# EAGLE design ICS40300-preamp-surfacemount_Rev-E (EAGLE 8.2.1)
COMPANY: ADAFRUIT INDUSTRIES; DRAWN: KTOWN; REV: A
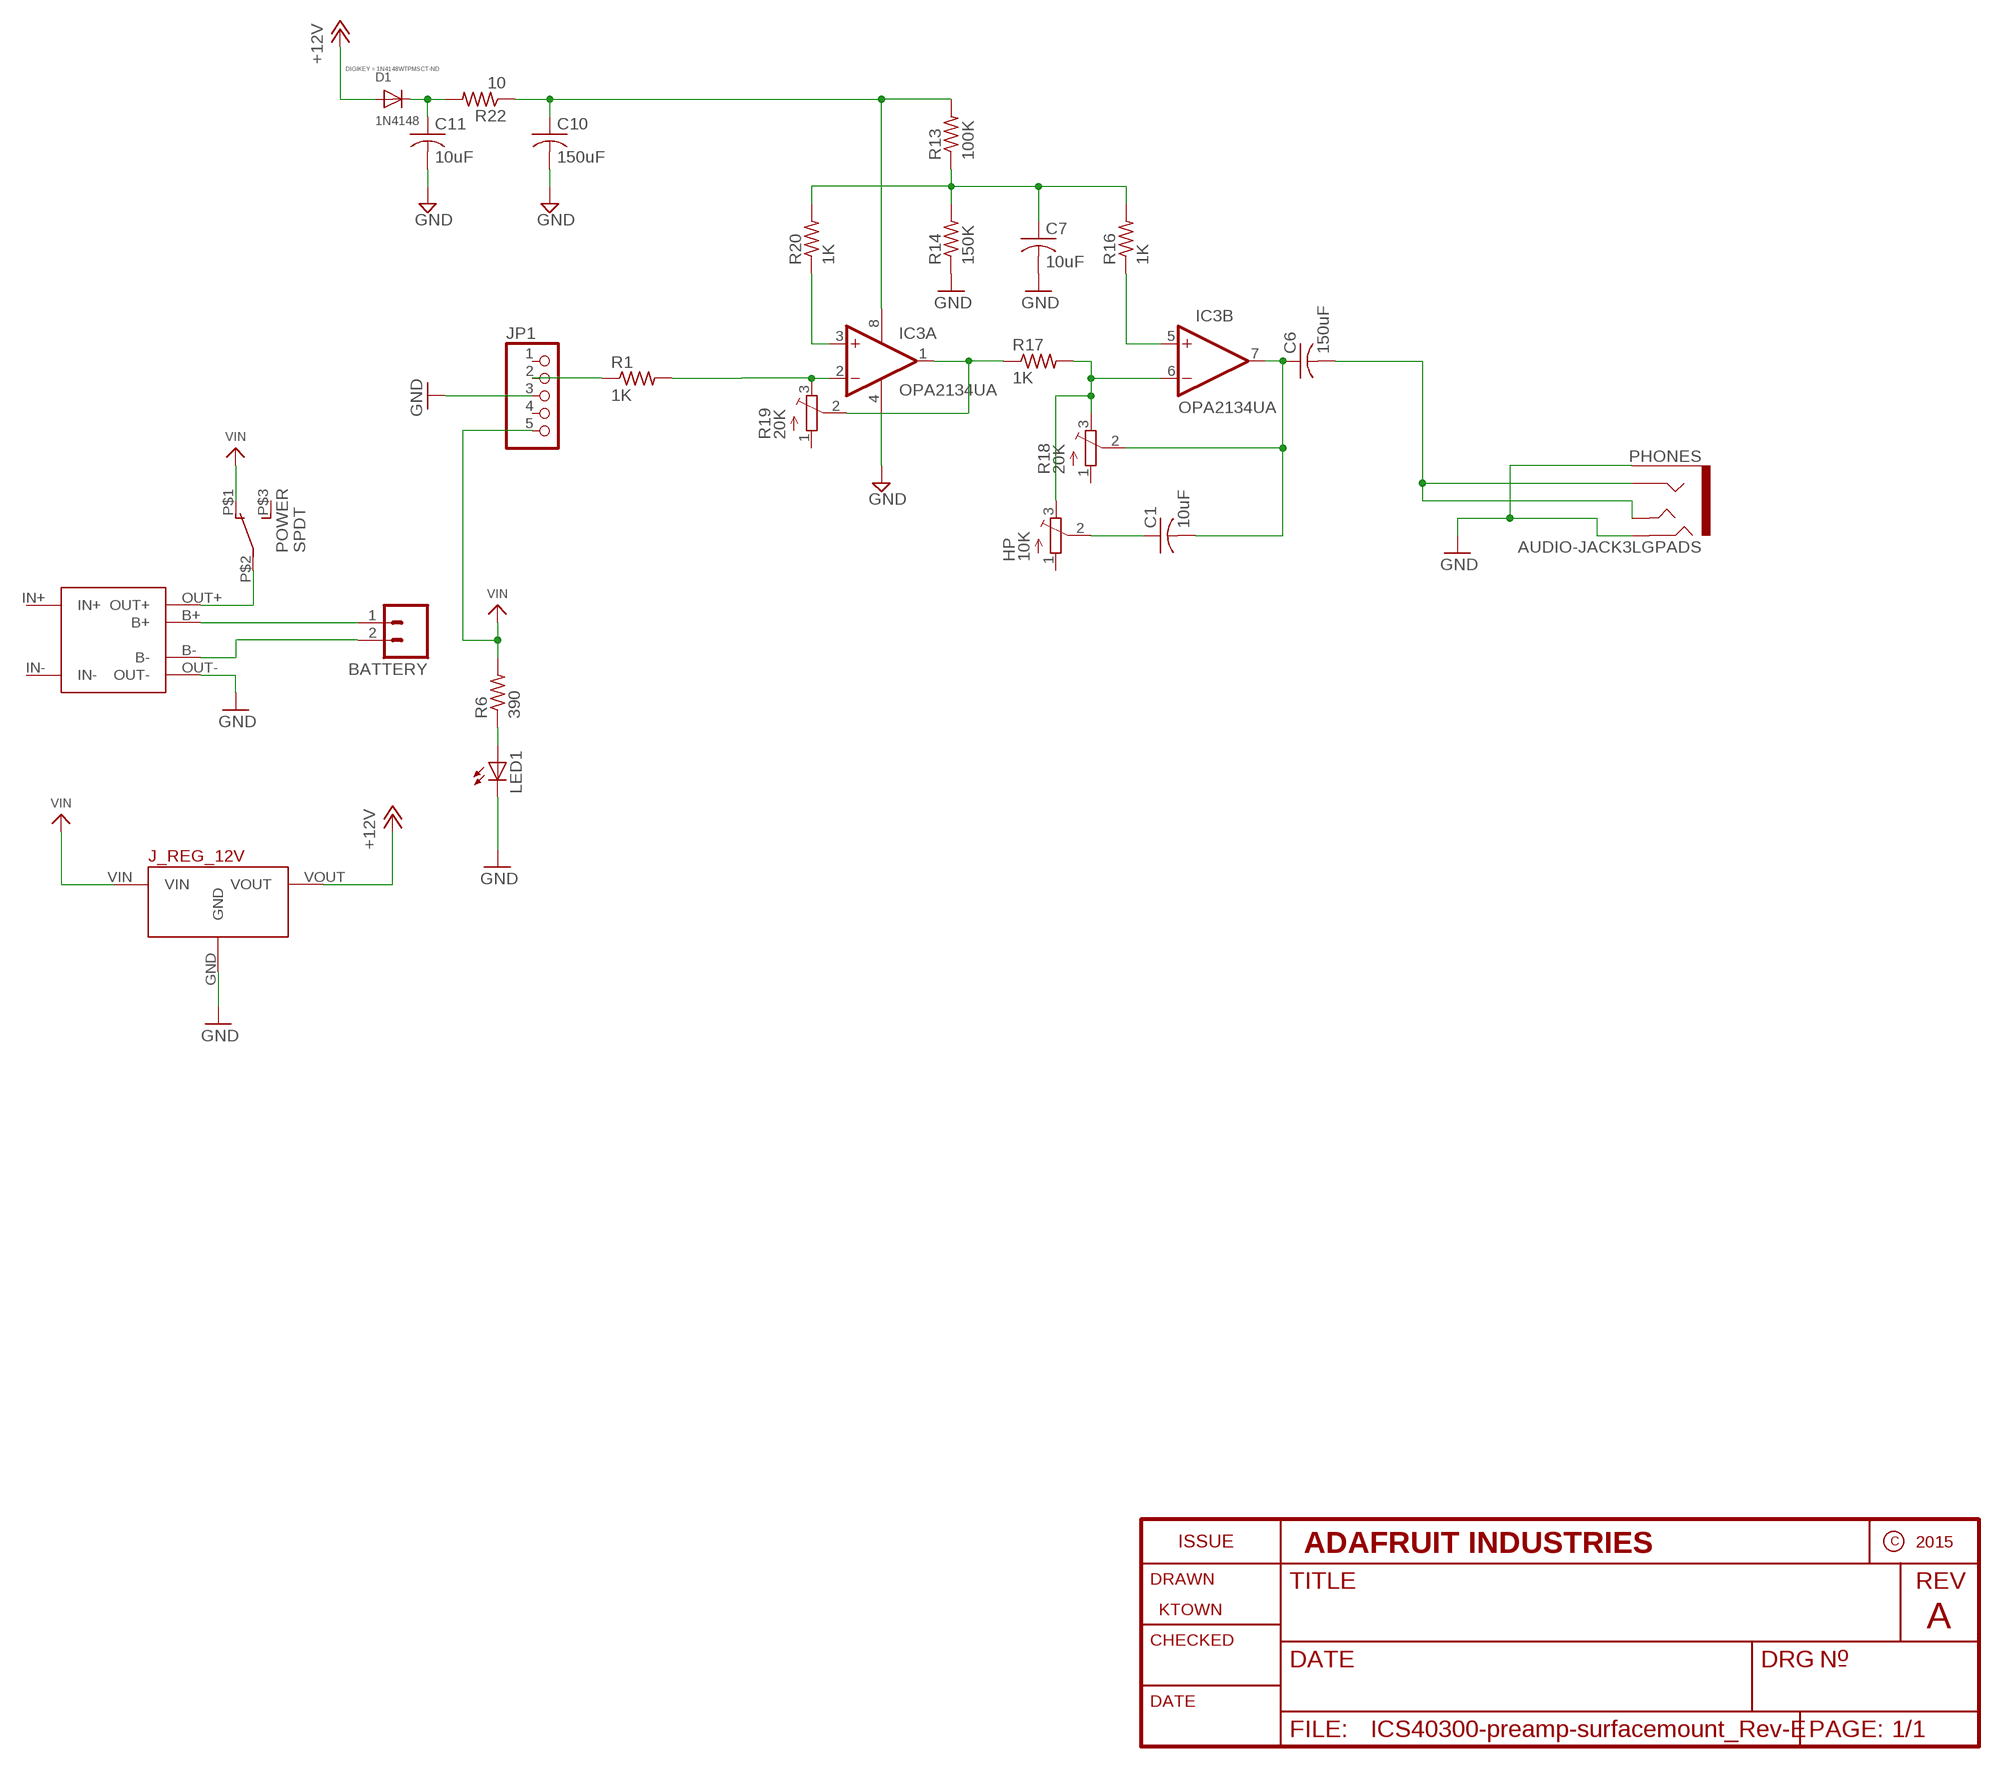
[diagram p0: schematic, sheet 1]

## Parts
BATTERY  M02LOCK  [1X02_LOCK]
C1  10uF  C-USC0805K  [C0805K]
C6  150uF  C-US6032  [CT6032]
C7  10uF  C-USC0805K  [C0805K]
C10  150uF  C-US6032  [CT6032]
C11  10uF  C-USC0805K  [C0805K]
D1  1N4148  DIODESOD-123  [SOD-123]
HP  10K  TRIMPOTTC33X  [TC33X]
IC3  OPA2134UA  [SO08]
J_REG_12V  POLOLU_VOLTAGE_REGULATORS_3PIN  [POLOLU_5V-12V_STEPUP_U3V12F5-U3V12F12]
JP1  HEADER-1X576MIL  [1X05_ROUND_76]
LED1  LED3MM  [LED3MM]
PHONES  AUDIO-JACK3LGPADS  [AUDIO-JACK-TRRS-SMD]
POWER  SPDT  SWITCH_SPDTCL-SB-12B  [SWITCH_SPDT_CL-SB-12B]
R1  1K  R-US_R0805  [R0805]
R6  390  R-US_R0805  [R0805]
R13  100K  R-US_R0603  [R0603]
R14  150K  R-US_R0603  [R0603]
R16  1K  R-US_R0603  [R0603]
R17  1K  R-US_R0603  [R0603]
R18  20K  TRIMPOTTC33X  [TC33X]
R19  20K  TRIMPOTTC33X  [TC33X]
R20  1K  R-US_R0603  [R0603]
R22  10  R-US_R0603  [R0603]
U$1  TP4056-MODULETP4056  [TP4056-LITHIUM-PROTECTED-MODULE-MOVED-PAD]

## Nets
+12V: D1.A J_REG_12V.VOUT
GND: C7.2 C10.- C11.2 IC3.4(A:V-) J_REG_12V.GND JP1.3 LED1.K(C) PHONES.EARTH PHONES.RING2 R14.1 U$1.OUT-
N$1: JP1.2 R1.1
N$3: POWER.P$2 U$1.OUT+
N$4: C1.1 HP.2(S)
N$5: BATTERY.1 U$1.B+
N$6: BATTERY.2 U$1.B-
N$13: IC3.5(B:+IN) R16.1
N$14: C1.2 C6.+ IC3.7(B:OUT) R18.2(S)
N$15: HP.3(E) IC3.6(B:-IN) R17.2 R18.3(E)
N$16: LED1.A R6.1
N$17: C7.1 R13.1 R14.2 R16.2 R20.2
N$18: IC3.3(A:+IN) R20.1
N$19: IC3.1(A:OUT) R17.1 R19.2(S)
N$21: IC3.2(A:-IN) R1.2 R19.3(E)
N$25: C6.- PHONES.RING1 PHONES.TIP
N$28: C11.1 D1.C R22.2
N$32: C10.+ IC3.8(A:V+) R13.2 R22.1
VIN: J_REG_12V.VIN JP1.5 POWER.P$1 R6.2
Unconnected: HP.1(A) JP1.1 JP1.4 POWER.P$3 R18.1(A) R19.1(A)

## Power pins joined to a net without a drawn wire
IN+: U$1.IN+
IN-: U$1.IN-

## Library data of the parts
BATTERY = CMU-ArtFab:M02: Header 2 Standard 2-pin 0.1" header. Use with straight break away headers (SKU : PRT-00116), right angle break away headers (PRT-00553), swiss pins (PRT-00743), machine pins (PRT-00117), and female headers (PRT-00115). Molex polarized connector foot print use with SKU : PRT-08233 with associated crimp pins and housings.
C1 C6 C7 C10 C11 = adafruit:C-US: CAPACITOR, American symbol
D1 = adafruit:DIODE: Diode SMADIODE - SMA Surface Mount Package 20V 1A Schottky Diode Digikey: 641-1014-6-ND DO-1N4148 - Through Hole Small Current Diode SOD-123 20V 1 A (.5mV Vf) Schottky Diode - Digikey: MBRX120TPMSCT-ND SOD-323 10V 570mA (.38mV Vf, 3ns) Schottky Diode - Digikey: ZLLS410CT-ND SOD-523 30V 30mA Schottky Diode (RB751S-40TE61) - Digikey: RB751S-40TE61CT-ND SOT23-R/W - SOT23 Package (R = Solder Paste/Reflow Ovens, W = Hand-Soldering) BAT54Film 40V 300mA - Digikey: 497-7162-1-ND; DIGIKEY: 1N4148WTPMSCT-ND
HP R18 R19 = adafruit:TRIMPOT: SMT trimmer potentiometer part number TC33X http://www.ladyada.net/library/eagle
IC3 = linear:OPA2*: Dual Operational Amplifier Low Power, Single-Supply, Rail-To-Rail Operational Amplifier Source: http://focus.ti.com/lit/ds/symlink/opa2345.pdf http://focus.ti.com .. opa241.pdf http://focus.ti.com/lit/ds/symlink/opa2134.pdf
J_REG_12V = CMU-ArtFab:POLOLU_VOLTAGE_REGULATORS_3PIN: Polulu 5V Step-Up/Step-Down Voltage REgulator S7V7F5
JP1 = microbuilder:HEADER-1X5: PIN HEADER
LED1 = led:LED: LED OSRAM: - CHIPLED LG R971, LG N971, LY N971, LG Q971, LY Q971, LO R971, LY R971 LH N974, LH R974 LS Q976, LO Q976, LY Q976 LO Q996 - Hyper CHIPLED LW Q18S LB Q993, LB Q99A, LB R99A - SideLED LS A670, LO A670, LY A670, LG A670, LP A670 LB A673, LV A673, LT A673, LW A673 LH A674 LY A675 LS A676, LA A676, LO A676, LY A676, LW A676 LS A679, LY A679, LG A679 - Hyper Micro SIDELED® LS Y876, LA Y876, LO Y876, LY Y876 LT Y87S - SmartLED LW L88C, LW L88S LB L89C, LB L89S, LG L890 LS L89K, LO L89K, LY L89K LS L896, LA L896, LO L896, LY L896 - TOPLED LS T670, LO T670, LY T670, LG T670, LP T670 LSG T670, LSP T670, LSY T670, LOP T670, LYG T670 LG T671, LOG T671, LSG T671 LB T673, LV T673, LT T673, LW T673 LH T674 LS T676, LA T676, LO T676, LY T676, LB T676, LH T676, LSB T676, LW T676 LB T67C, LV T67C, LT T67C, LS T67K, LO T67K, LY T67K, LW E67C LS E67B, LA E67B, LO E67B, LY E67B, LB E67C, LV E67C, LT E67C LW T67C LS T679, LY T679, LG T679 LS T770, LO T770, LY T770, LG T770, LP T770 LB T773, LV T773, LT T773, LW T773 LH T774 LS E675, LA E675, LY E675, LS T675 LS T776, LA T776, LO T776, LY T776, LB T776 LHGB T686 LT T68C, LB T68C - Hyper Mini TOPLED® LB M676 - Mini TOPLED Santana® LG M470 LS M47K, LO M47K, LY M47K Source: http://www.osram.convergy.de LUXEON: - LUMILED® LXK2-PW12-R00, LXK2-PW12-S00, LXK2-PW14-U00, LXK2-PW14-V00 LXK2-PM12-R00, LXK2-PM12-S00, LXK2-PM14-U00 LXK2-PE12-Q00, LXK2-PE12-R00, LXK2-PE12-S00, LXK2-PE14-T00, LXK2-PE14-U00 LXK2-PB12-K00, LXK2-PB12-L00, LXK2-PB12-M00, LXK2-PB14-N00, LXK2-PB14-P00, LXK2-PB14-Q00 LXK2-PR12-L00, LXK2-PR12-M00, LXK2-PR14-Q00, LXK2-PR14-R00 LXK2-PD12-Q00, LXK2-PD12-R00, LXK2-PD12-S00 LXK2-PH12-R00, LXK2-PH12-S00 LXK2-PL12-P00, LXK2-PL12-Q00, LXK2-PL12-R00 Source: www.luxeon.com KINGBRIGHT: KA-3528ASYC Source: www.kingbright.com
PHONES = Daniel:AUDIO-JACK3: Audio jack - 3.5mm TRRS variety - two rings.
POWER = CMU-ArtFab:SWITCH_SPDT
R1 R6 R13 R14 R16 R17 R20 R22 = CMU-ArtFab:R-US_: RESISTOR, American symbol
U$1 = CMU-ArtFab:TP4056-MODULE

## Board
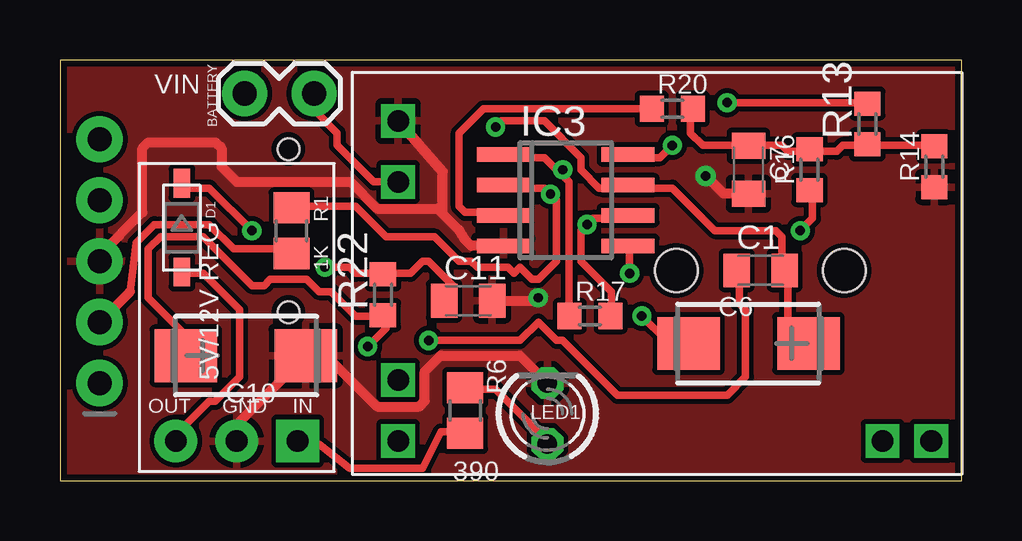
[diagram p1: board, top side]
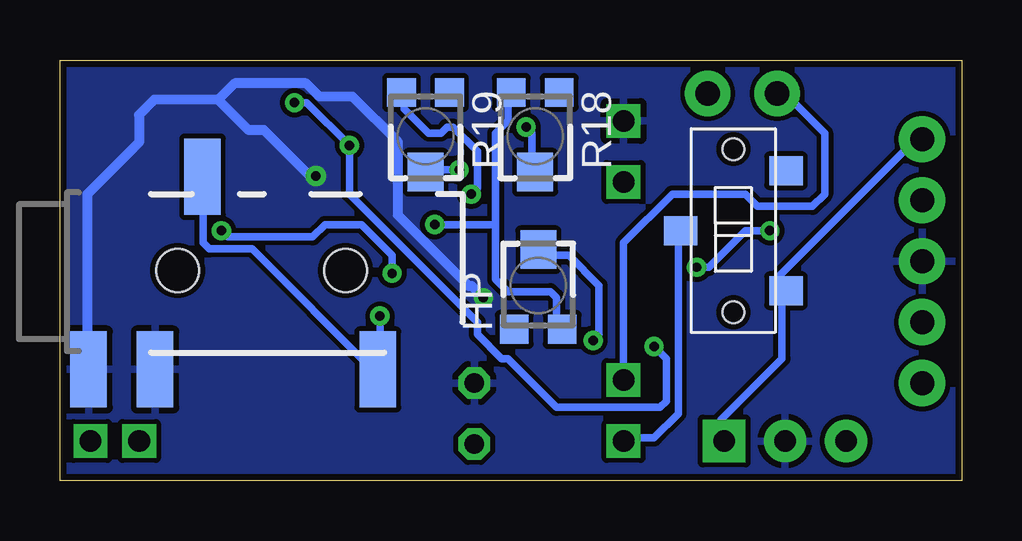
[diagram p2: board, bottom side, seen from below]

Size 37.59 x 17.53 mm. Coordinates in mm from the lower left corner, seen from the top.
Outline: 0,0 37.59,0 37.59,17.53 0,17.53 0,0
Copper layers (1*16): Top 0.035mm / dielectric 1.5mm / Bottom 0.035mm
Design rules "adafruit *": minimum track width 12mil, minimum drill 15.5mil, track to track 8mil, track to pad 8mil, pad to pad 8mil, via to via 8mil, smd to smd 8mil, copper to edge 10mil, drill to drill 8mil, minimum pad ring 10mil, minimum via ring 8mil, stop-mask expansion 2mil, vias tented up to drill 20mil, thermal gap 10mil

### Footprints (pad centres in the part's own frame; a part is rotated, then mirrored left to right if it is on the bottom)
1X02_LOCK = drill 1.016 pad 1.88: 1 -0.178,0; 2 2.718,0
C0805K = smd 1.1 x 1.4: 1 -1,0; 2 1,0
CT6032 = smd 2.6 x 2.2: + 2.5,0; - -2.5,0
SOD-123 = smd 1.2 x 0.7: A 1.85,0; C -1.85,0
TC33X = smd 1.2 x 1.2: 1 -1,-1.825; 3 1,-1.825 | smd 1.5 x 1.6: 2 0,1.5
SO08 = smd 0.6 x 2.2: 1 -1.905,-2.6; 2 -0.635,-2.6; 3 0.635,-2.6; 4 1.905,-2.6; 5 1.905,2.6; 6 0.635,2.6; 7 -0.635,2.6; 8 -1.905,2.6
POLOLU_5V-12V_STEPUP_U3V12F5-U3V12F12 = drill 0.9 pad 1.778: GND 0,-6.35; VOUT -2.54,-6.35 | drill 0.9 pad 1.778 square: VIN 2.54,-6.35
1X05_ROUND_76 = drill 1 pad 1.93: 1 -5.08,0; 2 -2.54,0; 3 0,0; 4 2.54,0; 5 5.08,0
LED3MM = drill 0.813 octagon: A -1.27,0; K 1.27,0
AUDIO-JACK-TRRS-SMD = smd 1.524 x 3.175: EARTH -2.114,-5.271; RING1 2.644,2.759; RING2 0.66,-5.271; TIP 9.948,-5.271 | hole 1.778: 1.6,-1.15; 8.6,-1.15
SWITCH_SPDT_CL-SB-12B = smd 1.2 x 1.4: P$1 -2.5,-2.2; P$2 0,2.2; P$3 2.5,-2.2 | hole 0.9: -3.4,0; 3.4,0
R0805 = smd 1.3 x 1.5: 1 -0.95,0; 2 0.95,0
R0603 = smd 1 x 1.1: 1 -0.85,0; 2 0.85,0
TP4056-LITHIUM-PROTECTED-MODULE-MOVED-PAD = drill 0.9 square: B+ 10.795,4.445; B- 10.795,-3.81; IN+ -11.43,6.985; IN- -9.398,6.985; OUT+ 10.795,6.985; OUT- 10.795,-6.35

### Placement (x,y rotation side)
BATTERY  7.87,16.13 0 top
C1  29.21,8.76 0 top
C6  28.7,5.71 0 top
C7  28.7,12.95 270 top
C10  7.75,5.21 180 top
C11  17.02,7.49 0 top
D1  5.08,10.54 270 top
HP  17.65,8.13 0 bottom
IC3  21.08,11.68 270 top
J_REG_12V  7.37,8 0 top
JP1  1.65,9.14 90 top
LED1  20.32,2.79 90 top
PHONES  34.29,9.91 0 bottom
POWER  9.52,10.41 90 bottom
R1  9.65,10.41 90 top
R6  16.89,2.92 270 top
R13  33.66,14.86 90 top
R14  36.45,13.08 90 top
R16  31.24,12.95 90 top
R17  22.1,6.86 0 top
R18  17.78,14.35 180 bottom
R19  22.35,14.35 180 bottom
R20  25.53,15.49 0 top
R22  13.46,7.75 90 top
U$1  24.89,8.64 180 top

### Tracks (layer width: path | path; a pad name or v marks a point on that pad's centre or on a via)
+12V
  Top 0.305: D1.A 5.21,8.64 5.97,8.64 7.49,7.11 7.49,4.32 6.48,3.3 6.22,3.3 4.7,1.78 J_REG_12V.VOUT
GND  (via drill 0.39 pad 0.8, 0.4 pad 0.85)
  Top 0.406: IC3.4 17.14,9.78 16.89,10.03 16.64,10.44 15.95,11.12 | U$1.OUT- 15.95,12.88 15.95,11.12 | JP1.3 1.65,9.4 3.43,11.18 3.43,13.84 3.68,14.1 6.48,14.1 6.73,13.84 6.73,13.08 7.37,12.45 12.11,12.45 13.23,11.34 15.74,11.34 15.95,11.12 | J_REG_12V.GND 7.37,2.33 C10.- 11.1,5.21 13.23,3.08 14.97,3.08 15.21,3.32 15.21,4.54 15.87,5.21 19.18,5.21 LED1.K | C11.2 19.81,7.49 v19.94,7.62 | C7.2 27.67,11.95 v26.92,12.7
  Bottom 0.406: v26.92,12.7 27.18,12.7 29.08,14.61 29.72,14.61 30.99,15.88 | 30.99,15.88 33.66,15.88 34.29,15.24 34.29,14.1 36.45,11.94 36.45,4.68 PHONES.EARTH | v19.94,7.62 20.42,8.1 20.54,8.1 23.51,11.06 23.51,14.11 25.4,16 26.77,16 27.32,16.55 30.31,16.55 30.99,15.88
  pour Top: 37.97,-0.76 37.97,19.05 -0.25,19.05 -0.25,-0.76
  pour Bottom: -0.25,-0.76 37.97,-0.76 37.97,19.81 -0.25,19.81
N$1
  Top 0.305: 2.92,7.87 3.17,9.91 3.94,10.67 6.22,10.67 7.24,9.65 9.52,9.65 R1.1
  Top 0.406: JP1.2 2.92,7.87
N$3
  Bottom 0.305: POWER.P$2 11.81,10.41 11.81,2.79 12.83,1.78 14.1,1.78 U$1.OUT+
N$4  (via drill 0.39)
  Top 0.305: v15.37,5.84 19.18,5.84 19.94,6.6 20.7,5.84 20.96,5.84 23.24,3.56 27.81,3.56 28.57,4.32 28.57,7.11 28.32,7.37 28.32,8.64 C1.1
  Bottom 0.305: v15.37,5.84 15.11,6.1 15.11,8.13 16.38,9.4 17.65,9.4 HP.2
N$5
  Bottom 0.305: U$1.B+ 14.1,9.91 12.07,11.94 9.02,11.94 8.51,11.43 6.22,11.43 5.71,11.94 5.71,14.48 7.49,16.26 BATTERY.1
N$6
  Top 0.305: U$1.B- 13.08,12.45 11.56,13.97 11.56,14.48 10.79,15.24 10.79,16 BATTERY.2
N$13  (via drill 0.39)
  Top 0.305: v30.86,10.41 31.37,10.92 31.37,11.94 R16.1 | v23.75,8.64 23.75,9.65 IC3.5
  Bottom 0.305: v30.86,10.41 30.61,10.16 27.05,10.16 26.54,10.67 25.02,10.67 23.75,9.4 v23.75,8.64
N$14  (via drill 0.39)
  Top 0.305: C6.+ 31.12,5.84 30.35,6.6 30.35,8.64 C1.2 30.1,8.89 30.1,10.16 29.85,10.41 27.3,10.41 25.53,12.19 24,12.19 IC3.7 23.75,12.19 22.48,12.19 21.72,12.95 21.72,13.46 20.19,14.99 18.41,14.99 v18.16,14.73
  Bottom 0.305: v18.16,14.73 17.91,14.48 17.91,12.95 R18.2
N$15  (via drill 0.39)
  Top 0.305: R17.2 22.99,6.86 22.99,7.87 21.72,9.14 21.72,10.41 v21.97,10.67 22.23,10.92 23.75,10.92 IC3.6
  Bottom 0.305: 19.43,10.67 19.43,14.48 18.92,14.99 18.92,16 R18.3 | 19.43,10.67 19.43,8.38 18.92,7.87 17.14,7.87 16.89,7.62 16.89,6.35 HP.3 | 19.43,10.67 v21.97,10.67
N$16
  Top 0.305: R6.1 16.89,3.81 18.16,3.81 20.45,1.52 LED1.A
N$17
  Top 0.305: R20.2 26.29,15.49 26.29,14.48 26.8,13.97 28.57,13.97 C7.1 28.83,13.97 30.1,13.97 30.35,13.72 31.12,13.72 R16.2 31.37,13.72 32.38,13.72 32.64,13.97 33.66,13.97 | 33.66,13.97 36.45,13.97 R14.2 | 33.66,13.97 R13.1
N$18
  Top 0.305: R20.1 17.65,15.49 16.64,14.48 16.64,11.43 16.89,11.18 18.41,11.18 IC3.3
N$19  (via drill 0.39)
  Top 0.305: 20.7,12.95 20.19,13.46 18.67,13.46 IC3.1 | 20.7,12.95 21.21,12.45 21.21,6.86 R17.1 | 20.7,12.95 v20.96,12.95
  Bottom 0.305: v20.96,12.95 22.23,12.95 R19.2
N$21  (via drill 0.39)
  Top 0.305: IC3.2 18.67,12.19 20.19,12.19 v20.45,11.94 20.7,11.68 20.7,9.14 19.94,8.38 19.69,8.38 19.18,8.89 18.92,8.64 18.67,8.89 17.4,8.89 17.14,9.14 16.64,9.14 15.62,10.16 13.59,10.16 12.32,11.43 9.78,11.43 R1.2
  Bottom 0.305: v20.45,11.94 20.19,12.19 20.19,13.72 21.21,14.73 21.46,14.73 21.72,14.48 22.23,14.48 23.24,15.49 23.24,16 R19.3
N$25  (via drill 0.39)
  Top 0.305: v24.26,6.86 25.27,5.84 26.04,5.84 C6.-
  Bottom 0.305: v24.26,6.86 24.26,4.83 PHONES.TIP 24.51,4.57 29.59,9.65 31.37,9.65 31.62,9.91 31.62,12.45 PHONES.RING1
N$28  (via drill 0.39)
  Top 0.305: C11.1 16.13,7.62 16.38,7.87 16.38,8.13 15.37,9.14 15.11,9.14 14.61,8.64 13.59,8.64 R22.2 13.34,8.64 12.32,8.64 12.07,8.89 v11.05,8.89 | v8,10.41 6.22,12.19 5.21,12.19 D1.C
  Bottom 0.305: v8,10.41 9.02,10.41 10.54,8.89 v11.05,8.89
N$32  (via drill 0.39)
  Top 0.305: v27.81,15.75 33.66,15.75 R13.2 | v25.53,13.97 25.02,13.46 24,13.46 IC3.8 | C10.+ 5.21,5.33 5.21,6.1 3.68,7.62 3.68,9.65 4.19,10.16 5.97,10.16 8,8.13 8.51,8.13 8.76,8.38 10.29,8.38 10.79,7.87 11.3,7.87 12.32,6.86 13.34,6.86 R22.1 13.59,6.86 13.59,6.35 v12.83,5.59
  Bottom 0.305: v27.81,15.75 27.3,15.75 v25.53,13.97 25.53,11.94 20.19,6.6 20.19,6.1 19.18,5.08 18.92,5.08 16.89,3.05 12.57,3.05 12.32,3.3 12.32,5.08 v12.83,5.59
VIN
  Top 0.305: R6.2 16.89,2.03 15.88,2.03 15.11,0.51 12.07,0.51 10.79,1.52 10.03,1.52 J_REG_12V.VIN
  Bottom 0.305: 7.49,7.87 7.49,5.08 10.03,2.54 10.03,1.78 J_REG_12V.VIN | JP1.5 2.16,13.72 2.41,13.72 7.75,8.38 7.75,8.13 7.49,7.87 | 7.49,7.87 POWER.P$1

### Text on the board
tNames: VIN